# Altium schematic sheet CAN.SchDoc
size A
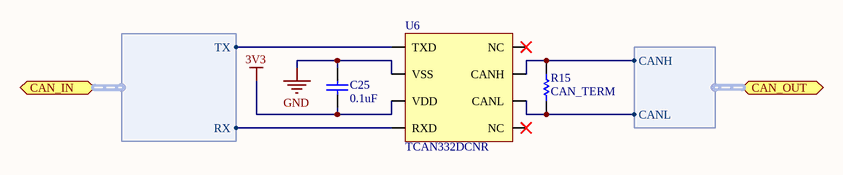
[diagram p0: CAN.SchDoc]

## Parts
C25  0.1uF  [CAPC0603(1608)100_L]
R15  CAN_TERM  [RESC0603(1608)_L]
U6  TCAN332DCNR  [SOT-23-8]

## Ports
CAN_IN (harness CAN_IN), CAN_OUT (harness CAN_OUT)

## Harnesses
CAN_IN: TX, RX
CAN_OUT: CANH, CANL

## Nets
3V3: C25.1 U6.3(VDD)
GND: C25.2 U6.2(VSS)
NetR15_1: R15.1 U6.6(CANL) ; port CAN_OUT.CANL
NetR15_2: R15.2 U6.7(CANH) ; port CAN_OUT.CANH
NetU6_1: U6.1(TXD) ; port CAN_IN.TX
NetU6_4: U6.4(RXD) ; port CAN_IN.RX

Not connected (* = marked no-connect by the designer): U6 5(NC)* 8(NC)*

## Library data of the parts
C25 = CMP-1035-02595-1: CAP 100nF 100V ±10% 0603 (1608 Metric) Thickness 1mm SMD; Tolerance: Â±10%; Case-EIA: 0603; Case-Metric: 1608; Rated Voltage: 100 V; Value: 100nF; Technology: SMT; Max Thickness: 1 mm
R15 = CMP-1012-00405-1: 120R 0.1W 1% 0603 (1608 Metric)  SMD; Value: 120.00 Ohm; Case-EIA: 0603; Case-Metric: 1608; Technology: SMT; Power: 0.1 W; Tolerance: 1 %
U6 = TCAN332DCNR: CAN Interface IC 3.3-V CAN Transceivers with CAN FD (Flexible Data Rate) 8-SOT-23 -40 to 125; Manufacturer: Texas Instruments; Mounting Technology: Surface Mount; PackageReference: SOT-23-8; PartNumber: TCAN332DCNR; PackageDescription: SOT23, 8-Leads